# Altium schematic sheet FOC_Controller.SchDoc: 直流无刷电机矢量控制器
size A3; Engineer: LuHeQiu; Revision: v0.1; SheetNumber: 1; SheetTotal: 2; Website1: https://www.luheqiu.com; Website2: https://gitee.com/luheqiu; Description1: 双路无刷直流电机矢量控制器(带电机驱动); Contact: luheqiu@mail.luheqiu.com; Description2: 12-36V(40V)  2×15A(25A); Description3: CAN USART USB  [SUPPORT]
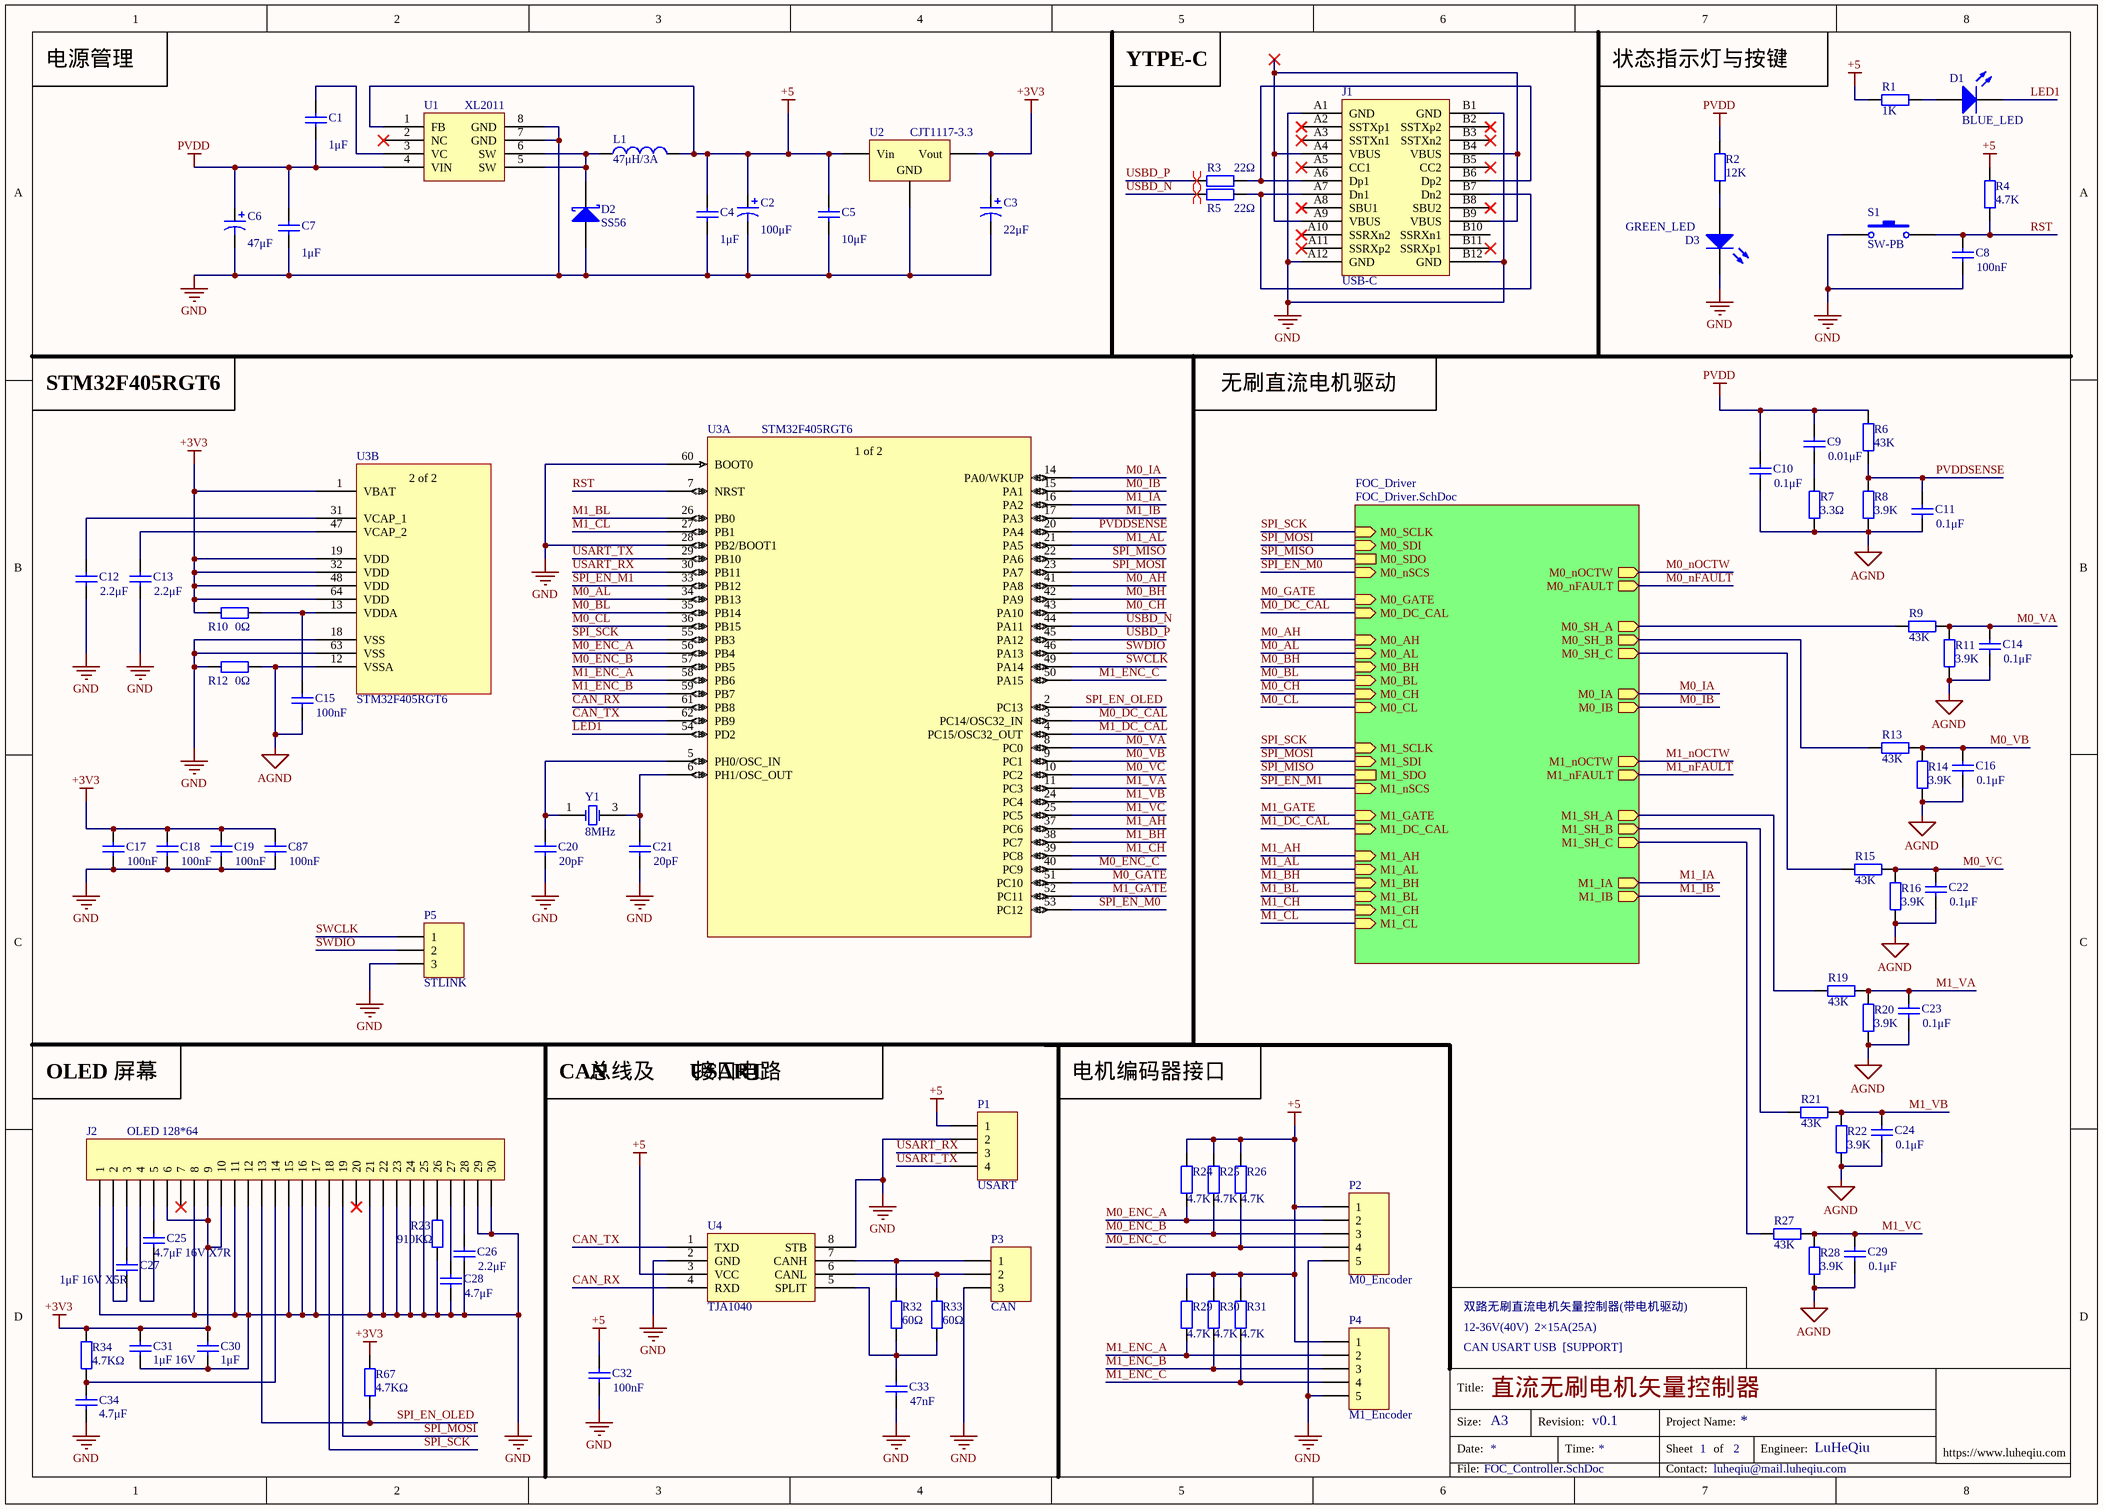
[diagram p0: FOC_Controller.SchDoc]

## Parts
C1  value 1μF  [C 0603_L]  (hidden comment: Cap)
C2  value 100μF  [C 1206_M]  (hidden comment: Cap Pol1)
C3  value 22μF  [CD A(3216)]  (hidden comment: Cap Pol1)
C4  value 1μF  [C 0603_L]  (hidden comment: Cap)
C5  value 10μF  [C 0603_M]  (hidden comment: Cap)
C6  value 47μF  [C 1206_M]  (hidden comment: Cap Pol1)
C7  value 1μF  [C 0603_L]  (hidden comment: Cap)
C8  value 100nF  [C 0603_L]  (hidden comment: Cap)
C9  value 0.01μF  [C 0603_L]  (hidden comment: Cap)
C10  value 0.1μF  [C 0603_L]  (hidden comment: Cap)
C11  value 0.1μF  [C 0603_L]  (hidden comment: Cap)
C12  value 2.2μF  [C 0603_L]  (hidden comment: Cap)
C13  value 2.2μF  [C 0603_L]  (hidden comment: Cap)
C14  value 0.1μF  [C 0603_L]  (hidden comment: Cap)
C15  value 100nF  [C 0603_L]  (hidden comment: Cap)
C16  value 0.1μF  [C 0603_L]  (hidden comment: Cap)
C17  value 100nF  [C 0603_L]  (hidden comment: Cap)
C18  value 100nF  [C 0603_L]  (hidden comment: Cap)
C19  value 100nF  [C 0603_L]  (hidden comment: Cap)
C20  value 20pF  [C 0603_L]  (hidden comment: Cap)
C21  value 20pF  [C 0603_L]  (hidden comment: Cap)
C22  value 0.1μF  [C 0603_L]  (hidden comment: Cap)
C23  value 0.1μF  [C 0603_L]  (hidden comment: Cap)
C24  value 0.1μF  [C 0603_L]  (hidden comment: Cap)
C25  value 4.7μF 16V X7R  [C 0603_L]  (hidden comment: Cap)
C26  value 2.2μF  [C 0603_L]  (hidden comment: Cap)
C27  value 1μF 16V X5R  [C 0603_L]  (hidden comment: Cap)
C28  value 4.7μF  [C 0603_L]  (hidden comment: Cap)
C29  value 0.1μF  [C 0603_L]  (hidden comment: Cap)
C30  value 1μF  [C 0603_L]  (hidden comment: Cap)
C31  value 1μF 16V  [C 0603_L]  (hidden comment: Cap)
C32  value 100nF  [C 0603_L]  (hidden comment: Cap)
C33  value 47nF  [C 0603_L]  (hidden comment: Cap)
C34  value 4.7μF  [C 0603_L]  (hidden comment: Cap)
C87  value 100nF  [C 0603_L]  (hidden comment: Cap)
D1  BLUE_LED  [LED 0603B]
D2  SS56  [SMC]
D3  GREEN_LED  [LED 0603G]
J1  USB-C  [USB-C-SMD_TYPE-C-USB-5]
J2  OLED 128*64  [OLED 0.96'' 128x64]
L1  value 47μH/3A  [L-SMD-0630]  (hidden comment: Inductor)
P1  USART  [SIPA04]
P2  M0_Encoder  [SIPB05]
P3  CAN  [SIPA03]
P4  M1_Encoder  [SIPB05]
P5  STLINK  [SIPA03]
R1  value 1K  [R 0603_L]  (hidden comment: Res2)
R2  value 12K  [R 0603_L]  (hidden comment: Res2)
R3  value 22Ω  [R 0603_L]  (hidden comment: Res2)
R4  value 4.7K  [R 0603_L]  (hidden comment: Res2)
R5  value 22Ω  [R 0603_L]  (hidden comment: Res2)
R6  value 43K  [R 0603_L]  (hidden comment: Res2)
R7  value 3.3Ω  [R 0603_L]  (hidden comment: Res2)
R8  value 3.9K  [R 0603_L]  (hidden comment: Res2)
R9  value 43K  [R 0603_L]  (hidden comment: Res2)
R10  value 0Ω  [R 0603_L]  (hidden comment: Res2)
R11  value 3.9K  [R 0603_L]  (hidden comment: Res2)
R12  value 0Ω  [R 0603_L]  (hidden comment: Res2)
R13  value 43K  [R 0603_L]  (hidden comment: Res2)
R14  value 3.9K  [R 0603_L]  (hidden comment: Res2)
R15  value 43K  [R 0603_L]  (hidden comment: Res2)
R16  value 3.9K  [R 0603_L]  (hidden comment: Res2)
R19  value 43K  [R 0603_L]  (hidden comment: Res2)
R20  value 3.9K  [R 0603_L]  (hidden comment: Res2)
R21  value 43K  [R 0603_L]  (hidden comment: Res2)
R22  value 3.9K  [R 0603_L]  (hidden comment: Res2)
R23  value 910KΩ  [R 0603_L]  (hidden comment: Res2)
R24  value 4.7K  [R 0603_L]  (hidden comment: Res2)
R25  value 4.7K  [R 0603_L]  (hidden comment: Res2)
R26  value 4.7K  [R 0603_L]  (hidden comment: Res2)
R27  value 43K  [R 0603_L]  (hidden comment: Res2)
R28  value 3.9K  [R 0603_L]  (hidden comment: Res2)
R29  value 4.7K  [R 0603_L]  (hidden comment: Res2)
R30  value 4.7K  [R 0603_L]  (hidden comment: Res2)
R31  value 4.7K  [R 0603_L]  (hidden comment: Res2)
R32  value 60Ω  [R 0603_L]  (hidden comment: Res2)
R33  value 60Ω  [R 0603_L]  (hidden comment: Res2)
R34  value 4.7KΩ  [R 0603_L]  (hidden comment: Res2)
R67  value 4.7KΩ  [R 0603_L]  (hidden comment: Res2)
S1  SW-PB  [TSW SMD-6*6*5]
U1  XL2011  [SOP8_N]
U2  CJT1117-3.3  [SOT223_N]
U3  STM32F405RGT6  [LQFP64-10x10mm]  (parts A,B of 2)
U4  TJA1040  [SOP8_N]
Y1  8MHz  [OSC 3225-4P]

## Sub-sheets
FOC_Driver = FOC_Driver.SchDoc: M0_SCLK (in), M0_SDI (in), M0_SDO, M0_nSCS (in), M0_DC_CAL (in), M0_GATE (in), M0_AH (in), M0_AL (in), M0_BH (in), M0_BL (in), M0_CH (in), M0_CL (in), M0_SH_C (out), M1_SH_B (out), M0_nFAULT (out), M1_DC_CAL (in), M0_nOCTW (out), M1_nSCS (in), M1_nOCTW (out), M1_AL (in), M1_AH (in), M0_SH_A (out), M1_GATE (in), M1_IA (out), M0_IB (out), M1_IB (out), M1_CH (in), M0_IA (out), M1_SDO, M1_BL (in), M1_SH_A (out), M1_SH_C (out), M1_SCLK (in), M1_SDI (in), M1_nFAULT (out), M0_SH_B (out), M1_BH (in), M1_CL (in)

## Nets
+3V3: C3.1 C17.2 C18.2 C19.2 C30.2 C31.2 C87.2 J2.6 J2.9 J2.10 R10.1 R34.2 R67.1 U2.3(Vout) U3.1(VBAT) U3.19(VDD) U3.32(VDD) U3.48(VDD) U3.64(VDD)
+5: C2.1 C4.2 C5.2 C32.2 L1.2 P1.1 P2.1 P4.1 R1.1 R4.2 R24.2 R25.2 R26.2 R29.2 R30.2 R31.2 U1.1(FB) U2.1(Vin) U4.3(VCC)
AGND: C10.1 C11.1 C14.1 C15.1 C16.1 C22.1 C23.1 C24.1 C29.1 R7.2 R8.2 R11.2 R12.2 R14.2 R16.2 R20.2 R22.2 R28.2 U3.12(VSSA)
GND: C2.2 C3.2 C4.1 C5.1 C6.2 C7.1 C8.1 C12.1 C13.1 C17.1 C18.1 C19.1 C20.1 C21.1 C26.1 C28.1 C30.1 C31.1 C32.1 C33.1 C34.2 C87.1 D2.1(A) D3.2(K) J1.A1(GND) J1.A12(GND) J1.B1(GND) J1.B12(GND) J2.1 J2.8 J2.11 J2.12 J2.15 J2.16 J2.17 J2.21 J2.22 J2.23 J2.24 J2.25 J2.29 J2.30 P1.2 P2.5 P3.3 P4.5 P5.3 R12.1 R23.1 S1.1 U1.7(GND) U1.8(GND) U2.2(GND) U3.18(VSS) U3.28(PB2/BOOT1) U3.60(BOOT0) U3.63(VSS) U4.2(GND) U4.8(STB)
PVDD: C1.1 C6.1 C7.2 C9.2 C10.2 R2.1 R6.1 U1.4(VIN)
CAN_RX: U3.61(PB8) U4.4(RXD)
CAN_TX: U3.62(PB9) U4.1(TXD)
LED1: D1.2(K) U3.54(PD2)
M0_AH: U3.41(PA8) ; sheet FOC_Driver/M0_AH
M0_AL: U3.34(PB13) ; sheet FOC_Driver/M0_AL
M0_BH: U3.42(PA9) ; sheet FOC_Driver/M0_BH
M0_BL: U3.35(PB14) ; sheet FOC_Driver/M0_BL
M0_CH: U3.43(PA10) ; sheet FOC_Driver/M0_CH
M0_CL: U3.36(PB15) ; sheet FOC_Driver/M0_CL
M0_DC_CAL: U3.3(PC14/OSC32_IN) ; sheet FOC_Driver/M0_DC_CAL
M0_ENC_A: P2.2 R24.1 U3.56(PB4)
M0_ENC_B: P2.3 R25.1 U3.57(PB5)
M0_ENC_C: P2.4 R26.1 U3.40(PC9)
M0_GATE: U3.51(PC10) ; sheet FOC_Driver/M0_GATE
M0_IA: U3.14(PA0/WKUP) ; sheet FOC_Driver/M0_IA
M0_IB: U3.15(PA1) ; sheet FOC_Driver/M0_IB
M0_nFAULT: sheet FOC_Driver/M0_nFAULT
M0_nOCTW: sheet FOC_Driver/M0_nOCTW
M0_VA: C14.2 R9.2 R11.1 U3.8(PC0)
M0_VB: C16.2 R13.2 R14.1 U3.9(PC1)
M0_VC: C22.2 R15.2 R16.1 U3.10(PC2)
M1_AH: U3.37(PC6) ; sheet FOC_Driver/M1_AH
M1_AL: U3.21(PA5) ; sheet FOC_Driver/M1_AL
M1_BH: U3.38(PC7) ; sheet FOC_Driver/M1_BH
M1_BL: U3.26(PB0) ; sheet FOC_Driver/M1_BL
M1_CH: U3.39(PC8) ; sheet FOC_Driver/M1_CH
M1_CL: U3.27(PB1) ; sheet FOC_Driver/M1_CL
M1_DC_CAL: U3.4(PC15/OSC32_OUT) ; sheet FOC_Driver/M1_DC_CAL
M1_ENC_A: P4.2 R29.1 U3.58(PB6)
M1_ENC_B: P4.3 R30.1 U3.59(PB7)
M1_ENC_C: P4.4 R31.1 U3.50(PA15)
M1_GATE: U3.52(PC11) ; sheet FOC_Driver/M1_GATE
M1_IA: U3.16(PA2) ; sheet FOC_Driver/M1_IA
M1_IB: U3.17(PA3) ; sheet FOC_Driver/M1_IB
M1_nFAULT: sheet FOC_Driver/M1_nFAULT
M1_nOCTW: sheet FOC_Driver/M1_nOCTW
M1_VA: C23.2 R19.2 R20.1 U3.11(PC3)
M1_VB: C24.2 R21.2 R22.1 U3.24(PC4)
M1_VC: C29.2 R27.2 R28.1 U3.25(PC5)
PVDDSENSE: C11.2 R6.2 R8.1 U3.20(PA4)
RST: C8.2 R4.1 S1.2 U3.7(NRST)
SPI_EN_M0: U3.53(PC12) ; sheet FOC_Driver/M0_nSCS
SPI_EN_M1: U3.33(PB12) ; sheet FOC_Driver/M1_nSCS
SPI_EN_OLED: J2.13 R67.2 U3.2(PC13)
SPI_MISO: U3.22(PA6) ; sheet FOC_Driver/M0_SDO, sheet FOC_Driver/M1_SDO
SPI_MOSI: J2.19 U3.23(PA7) ; sheet FOC_Driver/M0_SDI, sheet FOC_Driver/M1_SDI
SPI_SCK: J2.18 U3.55(PB3) ; sheet FOC_Driver/M0_SCLK, sheet FOC_Driver/M1_SCLK
SWCLK: P5.1 U3.49(PA14)
SWDIO: P5.2 U3.46(PA13)
USART_RX: P1.3 U3.30(PB11)
USART_TX: P1.4 U3.29(PB10)
USBD_N: R5.1 U3.44(PA11)
USBD_P: R3.1 U3.45(PA12)
NetC1_2: C1.2 U1.3(VC)
NetC9_1: C9.1 R7.1
NetC12_2: C12.2 U3.31(VCAP_1)
NetC13_2: C13.2 U3.47(VCAP_2)
NetC15_2: C15.2 R10.2 U3.13(VDDA)
NetC20_2: C20.2 U3.5(PH0/OSC_IN) Y1.1(OSC1)
NetC21_2: C21.2 U3.6(PH1/OSC_OUT) Y1.3(OSC2)
NetC25_1: C25.1 J2.5
NetC25_2: C25.2 J2.4
NetC26_2: C26.2 J2.28
NetC27_1: C27.1 J2.3
NetC27_2: C27.2 J2.2
NetC28_2: C28.2 J2.27
NetC33_2: C33.2 R32.1 R33.2 U4.5(SPLIT)
NetC34_1: C34.1 J2.14 R34.1
NetD1_1: D1.1(A) R1.2
NetD2_3: D2.3(K) L1.1 U1.5(SW) U1.6(SW)
NetD3_1: D3.1(A) R2.2
NetJ1_A4: J1.A4(VBUS) J1.A9(VBUS) J1.B4(VBUS) J1.B9(VBUS)
NetJ1_A6: J1.A6(Dp1) J1.B6(Dp2) R3.2
NetJ1_A7: J1.A7(Dn1) J1.B7(Dn2) R5.2
NetJ2_26: J2.26 R23.2
NetP3_1: P3.1 R32.2 U4.7(CANH)
NetP3_2: P3.2 R33.1 U4.6(CANL)
NetR9_1: R9.1 ; sheet FOC_Driver/M0_SH_A
NetR13_1: R13.1 ; sheet FOC_Driver/M0_SH_B
NetR15_1: R15.1 ; sheet FOC_Driver/M0_SH_C
NetR19_1: R19.1 ; sheet FOC_Driver/M1_SH_A
NetR21_1: R21.1 ; sheet FOC_Driver/M1_SH_B
NetR27_1: R27.1 ; sheet FOC_Driver/M1_SH_C

Not connected (* = marked no-connect by the designer): J1 A2(SSTXp1)* A3(SSTXn1)* A5(CC1)* A8(SBU1)* A10(SSRXn2)* A11(SSRXp2)* B2(SSTXp2)* B3(SSTXn2)* B5(CC2)* B8(SBU2)* B10(SSRXn1) B11(SSRXp1)*; J2 7* 20*; U1 2(NC)*

## Layout directives
differential pair: USBD_N, USBD_P

## Notes on the sheet
- 电源管理
- YTPE-C
- 状态指示灯与按键
- STM32F405RGT6
- 无刷直流电机驱动
- OLED
- 屏幕
- CAN               USART
- 总线及       接口电路
- 电机编码器接口
- Title:
- Size:
- Date:
- A3
- Revision:
- Time:
- Project Name:
- Sheet
- of
- Engineer:
- File:
- Contact:
- (in symbol STM32F405RGT6, part A) 1 of 2
- (in symbol STM32F405RGT6, part B) 2 of 2

## Library data of the parts
C1 C4 C5 C7-C34 C87 = Cap: Capacitor; Published: 8-Jun-2000; LatestRevisionDate: 17-Jul-2002; LatestRevisionNote: Re-released for DXP Platform.; PackageReference: RAD-0.3; Publisher: Altium Limited; PackageDescription: Radial Cap, Thru-Hole; 2 Leads; 0.3 in Pin Spacing
C2 C3 C6 = Cap Pol1: Polarized Capacitor (Radial); Published: 8-Jun-2000; LatestRevisionDate: 17-Jul-2002; LatestRevisionNote: Re-released for DXP Platform.; PackageReference: RB7.6-15; Publisher: Altium Limited; PackageDescription: Polarized Capacitor (Radial); 2 Leads
D1 D3 = LED2: Typical RED, GREEN, YELLOW, AMBER GaAs LED; Published: 8-Jun-2000; LatestRevisionDate: 17-Jul-2002; LatestRevisionNote: Re-released for DXP Platform.; PackageVersion: Feb-2002; PackageReference: 3.2X1.6X1.1; Publisher: Altium Limited; PackageDescription: SM LED; 2 Flat Leads
D2 = Diode BAS70: Silicon AF Schottky Diode for High-Speed Switching; pin to pad: 3>2; Note: Pin 2 is not connected and not drawn.; Published: 21-Mar-2003; LatestRevisionDate: 29-May-2009; LatestRevisionNote: IPC-7351 Footprint Added.; DatasheetVersion: Oct-1999; PackageVersion: Sep-2001; PackageReference: SOT-23; Publisher: Altium Limited; PackageDescription: 3-Pin SOT-23 Package 0.95 mm Pitch, 2.5 mm Lead Span; ComponentLink1Description: Manufacturer Link; ComponentLink1URL: http://www.infineon.com/; ComponentLink2Description: Datasheet; ComponentLink2URL: http://www.infineon.com/upload/Document/cmc_upload/documents/009/382/bas40_bas140series_1.pdf
J1 = USB-C/S: USB-C型母接口; BOM名称: USB-C型母接口
J2 = Header 30: Header, 30-Pin; LatestRevisionDate: 17-Jul-2002; LatestRevisionNote: Re-released for DXP Platform.; Publisher: Altium Limited
L1 = Inductor: Code_IEC: 1005; Published: 8-Jun-2000; LatestRevisionDate: 29-May-2009; LatestRevisionNote: IPC-7351 Footprint Added.; PackageReference: 0402-A; Publisher: Altium Limited; PackageDescription: Chip Inductor; Code_JEITA: 0402
P1 = Header 4: Header, 4-Pin; LatestRevisionDate: 17-Jul-2002; LatestRevisionNote: Re-released for DXP Platform.; Publisher: Altium Limited
P2 P4 = Header 5: Header, 5-Pin; LatestRevisionDate: 17-Jul-2002; LatestRevisionNote: Re-released for DXP Platform.; Publisher: Altium Limited
P3 P5 = Header 3: Header, 3-Pin; LatestRevisionDate: 17-Jul-2002; LatestRevisionNote: Re-released for DXP Platform.; Publisher: Altium Limited
R1-R16 R19-R34 R67 = Res2: Resistor; Published: 8-Jun-2000; LatestRevisionDate: 17-Jul-2002; LatestRevisionNote: Re-released for DXP Platform.; PackageReference: AXIAL-0.4; Publisher: Altium Limited; PackageDescription: Axial Device, Thru-Hole; 2 Leads; 0.4 in Pin Spacing
S1 = SW-PB: Switch; Published: 24-Mar-1999; LatestRevisionDate: 17-Jul-2002; LatestRevisionNote: Re-released for DXP Platform.; PackageReference: SPST-2; Publisher: Altium Limited; PackageDescription: Switch; 2 Leads
U1 = XL2011: 5V/2.1A DC-DC Buck电源芯片(<50V)
U2 = Volt Reg: Voltage Regulator; Published: 24-Mar-1999; LatestRevisionDate: 29-May-2009; LatestRevisionNote: IPC-7351 Footprint Added.; PackageReference: D2PAK; Publisher: Altium Limited; PackageDescription: 3-Pin Transistor Outline Package 2.54 mm Pitch, 15.1 mm Lead Span
U3 = STM32F405RGT6: No Description Available; Mfr_Name: STMicroelectronics; Copyright: Copyright (C) 2021 Ultra Librarian. All rights reserved.; Manufacturer_Part_Number: STM32F405RGT6; RefDes: RefDes; Type: DEV
U4 = TJA1040: CAN收发器
Y1 = XTAL: Crystal Oscillator; Published: 8-Jun-2000; LatestRevisionDate: 17-Jul-2002; LatestRevisionNote: Re-released for DXP Platform.; PackageReference: R38; Publisher: Altium Limited; PackageDescription: Crystal, Thru-Hole; 2 Leads; Body 3.1 x 8.2 mm (Dia.xH)